# EAGLE schematic BMS_24 (EAGLE 9.6.2)
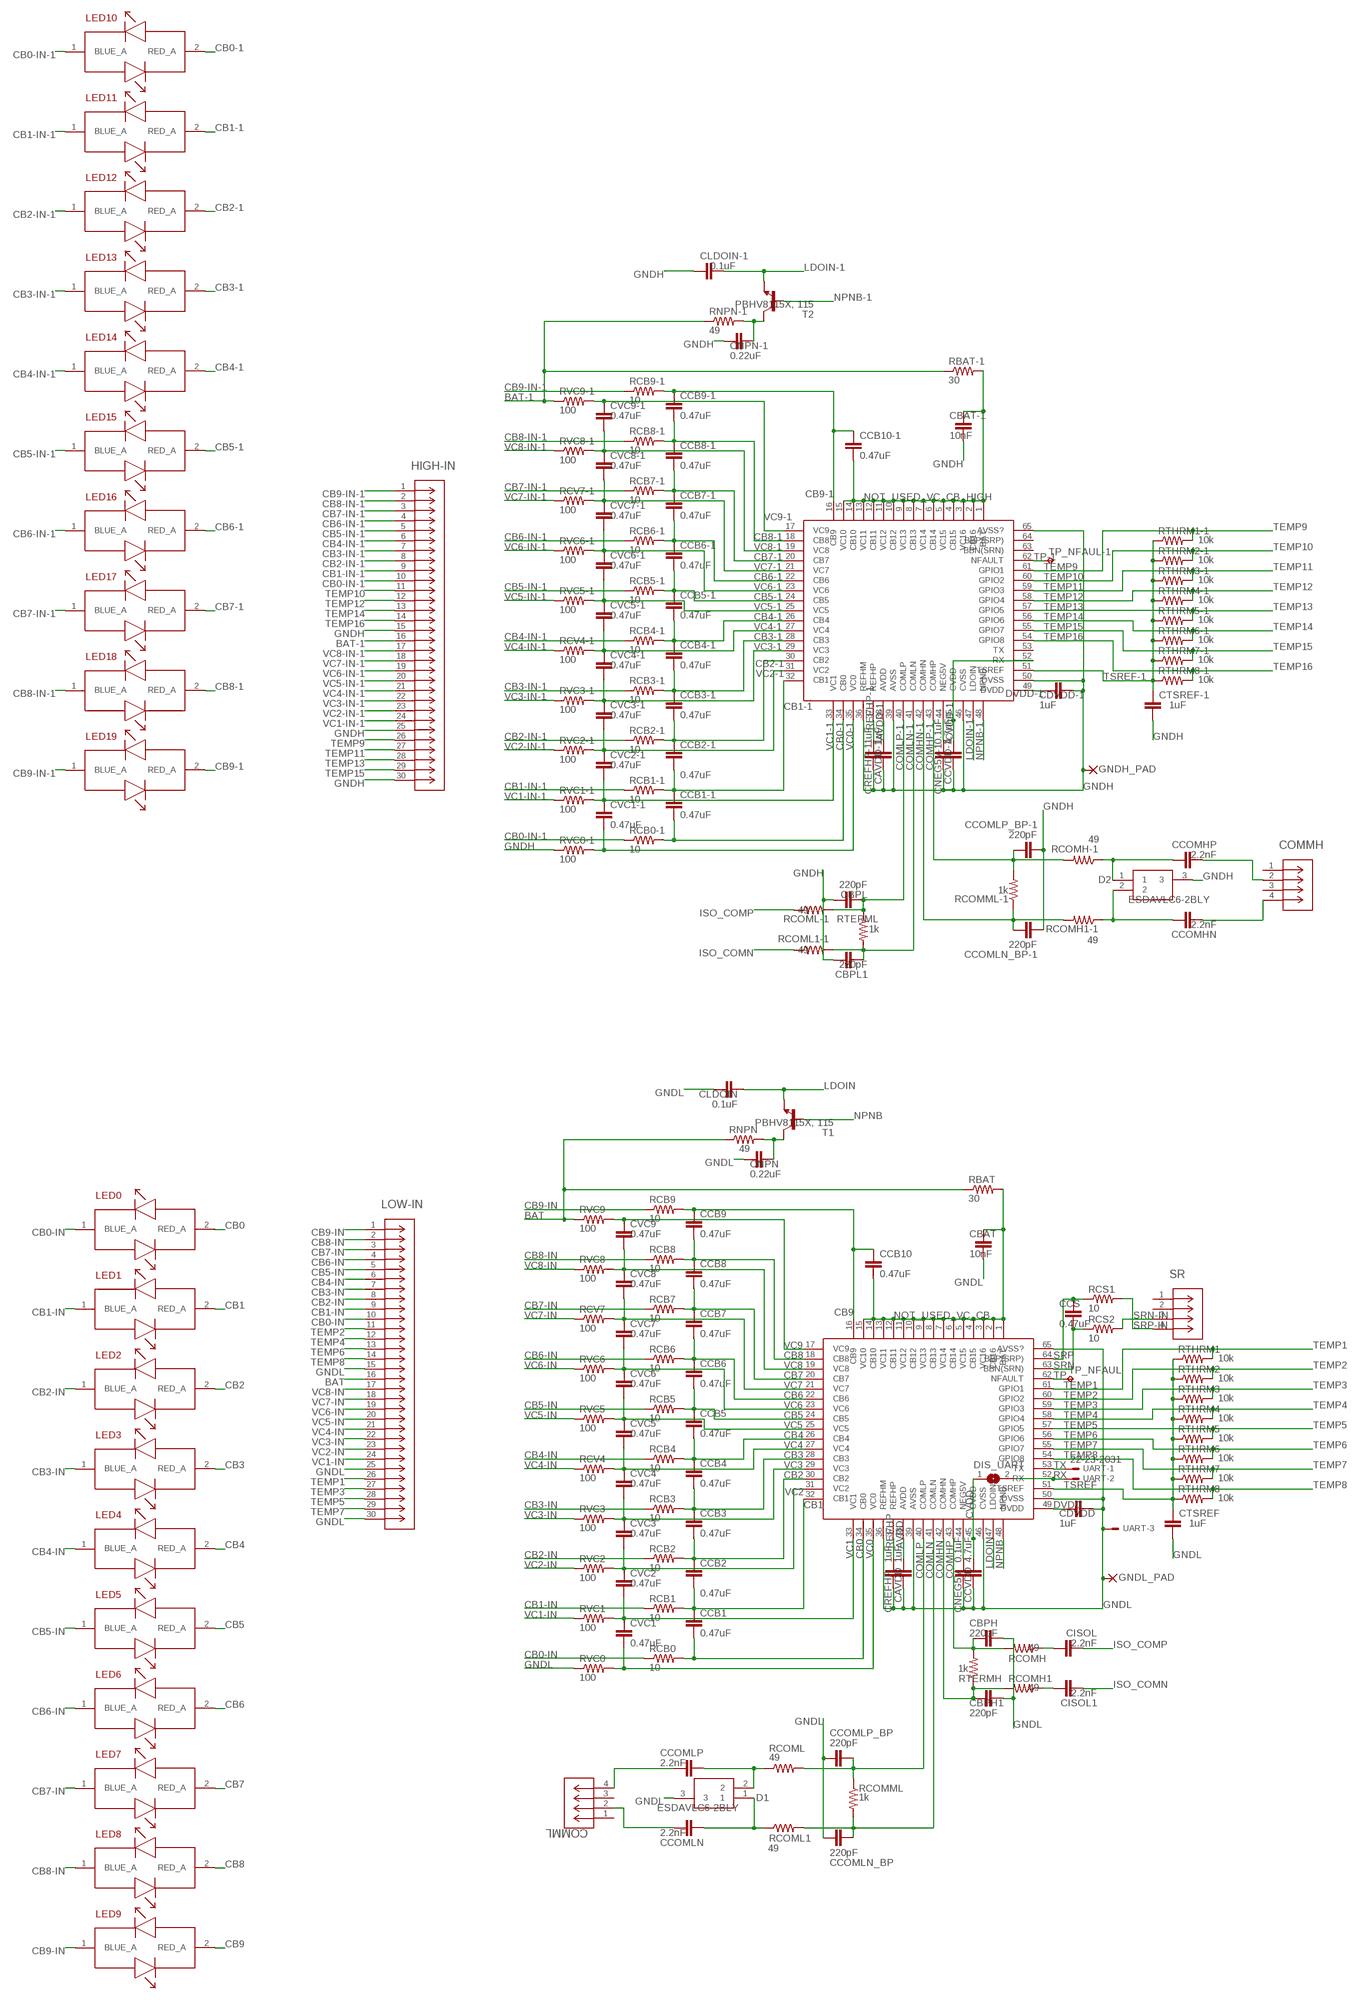
[diagram p0: schematic, sheet 1]

## Parts
CAVDD  1uF  CAPACITORC0603  [C0603]
CAVDD-1  1uF  CAPACITORC0603  [C0603]
CBAT  10nF  CAPACITORC0603  [C0603]
CBAT-1  10nF  CAPACITORC0603  [C0603]
CBPH  220pF  CAPACITORC0603  [C0603]
CBPH1  220pF  CAPACITORC0603  [C0603]
CBPL  220pF  CAPACITORC0603  [C0603]
CBPL1  220pF  CAPACITORC0603  [C0603]
CCB1  0.47uF  CAPACITORC0603  [C0603]
CCB1-1  0.47uF  CAPACITORC0603  [C0603]
CCB2  0.47uF  CAPACITORC0603  [C0603]
CCB2-1  0.47uF  CAPACITORC0603  [C0603]
CCB3  0.47uF  CAPACITORC0603  [C0603]
CCB3-1  0.47uF  CAPACITORC0603  [C0603]
CCB4  0.47uF  CAPACITORC0603  [C0603]
CCB4-1  0.47uF  CAPACITORC0603  [C0603]
CCB5  0.47uF  CAPACITORC0603  [C0603]
CCB5-1  0.47uF  CAPACITORC0603  [C0603]
CCB6  0.47uF  CAPACITORC0603  [C0603]
CCB6-1  0.47uF  CAPACITORC0603  [C0603]
CCB7  0.47uF  CAPACITORC0603  [C0603]
CCB7-1  0.47uF  CAPACITORC0603  [C0603]
CCB8  0.47uF  CAPACITORC0603  [C0603]
CCB8-1  0.47uF  CAPACITORC0603  [C0603]
CCB9  0.47uF  CAPACITORC0603  [C0603]
CCB9-1  0.47uF  CAPACITORC0603  [C0603]
CCB10  0.47uF  CAPACITORC0603  [C0603]
CCB10-1  0.47uF  CAPACITORC0603  [C0603]
CCOMHN  2.2nF  CAPACITORC0603  [C0603]
CCOMHP  2.2nF  CAPACITORC0603  [C0603]
CCOMLN  2.2nF  CAPACITORC0603  [C0603]
CCOMLN_BP  220pF  CAPACITORC0603  [C0603]
CCOMLN_BP-1  220pF  CAPACITORC0603  [C0603]
CCOMLP  2.2nF  CAPACITORC0603  [C0603]
CCOMLP_BP  220pF  CAPACITORC0603  [C0603]
CCOMLP_BP-1  220pF  CAPACITORC0603  [C0603]
CCS  0.47uF  CAPACITORC0603  [C0603]
CCVDD  4.7uF  CAPACITORC0603  [C0603]
CCVDD-1  4.7uF  CAPACITORC0603  [C0603]
CDVDD  1uF  CAPACITORC0603  [C0603]
CDVDD-1  1uF  CAPACITORC0603  [C0603]
CISOL  2.2nF  CAPACITORC0603  [C0603]
CISOL1  2.2nF  CAPACITORC0603  [C0603]
CLDOIN  0.1uF  CAPACITORC0603  [C0603]
CLDOIN-1  0.1uF  CAPACITORC0603  [C0603]
CNEG5V  0.1uF  CAPACITORC0603  [C0603]
CNEG5V-1  0.1uF  CAPACITORC0603  [C0603]
CNPN  0.22uF  CAPACITORC0603  [C0603]
CNPN-1  0.22uF  CAPACITORC0603  [C0603]
COMMH  DF11-4DP-2DSA(24)  [CON4_2X2_UF_DF11_HIR]
COMML  DF11-4DP-2DSA(24)  [CON4_2X2_UF_DF11_HIR]
CREFHP  1uF  CAPACITORC0603  [C0603]
CREFHP-1  1uF  CAPACITORC0603  [C0603]
CTSREF  1uF  CAPACITORC0603  [C0603]
CTSREF-1  1uF  CAPACITORC0603  [C0603]
CVC1  0.47uF  CAPACITORC0603  [C0603]
CVC1-1  0.47uF  CAPACITORC0603  [C0603]
CVC2  0.47uF  CAPACITORC0603  [C0603]
CVC2-1  0.47uF  CAPACITORC0603  [C0603]
CVC3  0.47uF  CAPACITORC0603  [C0603]
CVC3-1  0.47uF  CAPACITORC0603  [C0603]
CVC4  0.47uF  CAPACITORC0603  [C0603]
CVC4-1  0.47uF  CAPACITORC0603  [C0603]
CVC5  0.47uF  CAPACITORC0603  [C0603]
CVC5-1  0.47uF  CAPACITORC0603  [C0603]
CVC6  0.47uF  CAPACITORC0603  [C0603]
CVC6-1  0.47uF  CAPACITORC0603  [C0603]
CVC7  0.47uF  CAPACITORC0603  [C0603]
CVC7-1  0.47uF  CAPACITORC0603  [C0603]
CVC8  0.47uF  CAPACITORC0603  [C0603]
CVC8-1  0.47uF  CAPACITORC0603  [C0603]
CVC9  0.47uF  CAPACITORC0603  [C0603]
CVC9-1  0.47uF  CAPACITORC0603  [C0603]
D1  ESDAVLC6-2BLY  [SOT95P255X150-3N]
D2  ESDAVLC6-2BLY  [SOT95P255X150-3N]
DIS_UART  SJ  [SJ]
GNDH_PAD  SMD2  [SMD1,27-2,54]
GNDL_PAD  SMD2  [SMD1,27-2,54]
HIGH-IN  87606-315LF  [87606-315LF_AMP]
IC1  PBQ79656PAPTQ1  [QFP50P1200X1200X120-65N]
IC2  PBQ79656PAPTQ1  [QFP50P1200X1200X120-65N]
LED0  TJ-S1608SW6TNPGLCRB-A5  [TJ-S1608SW6TNPGLCRB-A5]
LED1  TJ-S1608SW6TNPGLCRB-A5  [TJ-S1608SW6TNPGLCRB-A5]
LED2  TJ-S1608SW6TNPGLCRB-A5  [TJ-S1608SW6TNPGLCRB-A5]
LED3  TJ-S1608SW6TNPGLCRB-A5  [TJ-S1608SW6TNPGLCRB-A5]
LED4  TJ-S1608SW6TNPGLCRB-A5  [TJ-S1608SW6TNPGLCRB-A5]
LED5  TJ-S1608SW6TNPGLCRB-A5  [TJ-S1608SW6TNPGLCRB-A5]
LED6  TJ-S1608SW6TNPGLCRB-A5  [TJ-S1608SW6TNPGLCRB-A5]
LED7  TJ-S1608SW6TNPGLCRB-A5  [TJ-S1608SW6TNPGLCRB-A5]
LED8  TJ-S1608SW6TNPGLCRB-A5  [TJ-S1608SW6TNPGLCRB-A5]
LED9  TJ-S1608SW6TNPGLCRB-A5  [TJ-S1608SW6TNPGLCRB-A5]
LED10  TJ-S1608SW6TNPGLCRB-A5  [TJ-S1608SW6TNPGLCRB-A5]
LED11  TJ-S1608SW6TNPGLCRB-A5  [TJ-S1608SW6TNPGLCRB-A5]
LED12  TJ-S1608SW6TNPGLCRB-A5  [TJ-S1608SW6TNPGLCRB-A5]
LED13  TJ-S1608SW6TNPGLCRB-A5  [TJ-S1608SW6TNPGLCRB-A5]
LED14  TJ-S1608SW6TNPGLCRB-A5  [TJ-S1608SW6TNPGLCRB-A5]
LED15  TJ-S1608SW6TNPGLCRB-A5  [TJ-S1608SW6TNPGLCRB-A5]
LED16  TJ-S1608SW6TNPGLCRB-A5  [TJ-S1608SW6TNPGLCRB-A5]
LED17  TJ-S1608SW6TNPGLCRB-A5  [TJ-S1608SW6TNPGLCRB-A5]
LED18  TJ-S1608SW6TNPGLCRB-A5  [TJ-S1608SW6TNPGLCRB-A5]
LED19  TJ-S1608SW6TNPGLCRB-A5  [TJ-S1608SW6TNPGLCRB-A5]
LOW-IN  87606-315LF  [87606-315LF_AMP]
RBAT  30  RESISTORR0603  [R0603]
RBAT-1  30  RESISTORR0603  [R0603]
RCB0  10  R-US_R1210  [R1210]
RCB0-1  10  R-US_R1210  [R1210]
RCB1  10  R-US_R1210  [R1210]
RCB1-1  10  R-US_R1210  [R1210]
RCB2  10  R-US_R1210  [R1210]
RCB2-1  10  R-US_R1210  [R1210]
RCB3  10  R-US_R1210  [R1210]
RCB3-1  10  R-US_R1210  [R1210]
RCB4  10  R-US_R1210  [R1210]
RCB4-1  10  R-US_R1210  [R1210]
RCB5  10  R-US_R1210  [R1210]
RCB5-1  10  R-US_R1210  [R1210]
RCB6  10  R-US_R1210  [R1210]
RCB6-1  10  R-US_R1210  [R1210]
RCB7  10  R-US_R1210  [R1210]
RCB7-1  10  R-US_R1210  [R1210]
RCB8  10  R-US_R1210  [R1210]
RCB8-1  10  R-US_R1210  [R1210]
RCB9  10  R-US_R1210  [R1210]
RCB9-1  10  R-US_R1210  [R1210]
RCOMH  49  RESISTORR0603  [R0603]
RCOMH1  49  RESISTORR0603  [R0603]
RCOMH1-1  49  RESISTORR0603  [R0603]
RCOMH-1  49  RESISTORR0603  [R0603]
RCOML  49  RESISTORR0603  [R0603]
RCOML1  49  RESISTORR0603  [R0603]
RCOML1-1  49  RESISTORR0603  [R0603]
RCOML-1  49  RESISTORR0603  [R0603]
RCOMML  1k  RESISTORR0603  [R0603]
RCOMML-1  1k  RESISTORR0603  [R0603]
RCS1  10  RESISTORR0603  [R0603]
RCS2  10  RESISTORR0603  [R0603]
RCV4  100  RESISTORR0603  [R0603]
RCV4-1  100  RESISTORR0603  [R0603]
RCV7  100  RESISTORR0603  [R0603]
RCV7-1  100  RESISTORR0603  [R0603]
RNPN  49  RESISTORR0603  [R0603]
RNPN-1  49  RESISTORR0603  [R0603]
RTERMH  1k  RESISTORR0603  [R0603]
RTERML  1k  RESISTORR0603  [R0603]
RTHRM1  10k  RESISTORR0603  [R0603]
RTHRM1-1  10k  RESISTORR0603  [R0603]
RTHRM2  10k  RESISTORR0603  [R0603]
RTHRM2-1  10k  RESISTORR0603  [R0603]
RTHRM3  10k  RESISTORR0603  [R0603]
RTHRM3-1  10k  RESISTORR0603  [R0603]
RTHRM4  10k  RESISTORR0603  [R0603]
RTHRM4-1  10k  RESISTORR0603  [R0603]
RTHRM5  10k  RESISTORR0603  [R0603]
RTHRM5-1  10k  RESISTORR0603  [R0603]
RTHRM6  10k  RESISTORR0603  [R0603]
RTHRM6-1  10k  RESISTORR0603  [R0603]
RTHRM7  10k  RESISTORR0603  [R0603]
RTHRM7-1  10k  RESISTORR0603  [R0603]
RTHRM8  10k  RESISTORR0603  [R0603]
RTHRM8-1  10k  RESISTORR0603  [R0603]
RVC0  100  RESISTORR0603  [R0603]
RVC0-1  100  RESISTORR0603  [R0603]
RVC1  100  RESISTORR0603  [R0603]
RVC1-1  100  RESISTORR0603  [R0603]
RVC2  100  RESISTORR0603  [R0603]
RVC2-1  100  RESISTORR0603  [R0603]
RVC3  100  RESISTORR0603  [R0603]
RVC3-1  100  RESISTORR0603  [R0603]
RVC5  100  RESISTORR0603  [R0603]
RVC5-1  100  RESISTORR0603  [R0603]
RVC6  100  RESISTORR0603  [R0603]
RVC6-1  100  RESISTORR0603  [R0603]
RVC8  100  RESISTORR0603  [R0603]
RVC8-1  100  RESISTORR0603  [R0603]
RVC9  100  RESISTORR0603  [R0603]
RVC9-1  100  RESISTORR0603  [R0603]
SR  DF11-4DP-2DSA(24)  [CON4_2X2_UF_DF11_HIR]
T1  PBHV8115X, 115  BC868-NPN-SOT89-BCE  [SOT89-BCE]
T2  PBHV8115X, 115  BC868-NPN-SOT89-BCE  [SOT89-BCE]
TP_NFAUL  TPB2,54  [B2,54]
TP_NFAUL-1  TPB2,54  [B2,54]
UART  22-23-2031  [22-23-2031]

## Nets
AVDD: CAVDD.1 IC2.38(AVDD)
AVDD-1: CAVDD-1.1 IC1.38(AVDD)
BAT: LOW-IN.16 RBAT.1 RNPN.1 RVC9.1
BAT-1: HIGH-IN.16 RBAT-1.1 RNPN-1.1 RVC9-1.1
CB0: CCB1.2 IC2.34(CB0) LED0.2(RED_A) RCB0.2
CB0-1: CCB1-1.2 IC1.34(CB0) LED10.2(RED_A) RCB0-1.2
CB0-IN: LED0.1(BLUE_A) LOW-IN.10 RCB0.1
CB0-IN-1: HIGH-IN.10 LED10.1(BLUE_A) RCB0-1.1
CB1: CCB1.1 CCB2.2 IC2.32(CB1) LED1.2(RED_A) RCB1.2
CB1-1: CCB1-1.1 CCB2-1.2 IC1.32(CB1) LED11.2(RED_A) RCB1-1.2
CB1-IN: LED1.1(BLUE_A) LOW-IN.9 RCB1.1
CB1-IN-1: HIGH-IN.9 LED11.1(BLUE_A) RCB1-1.1
CB2: CCB2.1 CCB3.2 IC2.30(CB2) LED2.2(RED_A) RCB2.2
CB2-1: CCB2-1.1 CCB3-1.2 IC1.30(CB2) LED12.2(RED_A) RCB2-1.2
CB2-IN: LED2.1(BLUE_A) LOW-IN.8 RCB2.1
CB2-IN-1: HIGH-IN.8 LED12.1(BLUE_A) RCB2-1.1
CB3: CCB3.1 CCB4.2 IC2.28(CB3) LED3.2(RED_A) RCB3.2
CB3-1: CCB3-1.1 CCB4-1.2 IC1.28(CB3) LED13.2(RED_A) RCB3-1.2
CB3-IN: LED3.1(BLUE_A) LOW-IN.7 RCB3.1
CB3-IN-1: HIGH-IN.7 LED13.1(BLUE_A) RCB3-1.1
CB4: CCB4.1 CCB5.2 IC2.26(CB4) LED4.2(RED_A) RCB4.2
CB4-1: CCB4-1.1 CCB5-1.2 IC1.26(CB4) LED14.2(RED_A) RCB4-1.2
CB4-IN: LED4.1(BLUE_A) LOW-IN.6 RCB4.1
CB4-IN-1: HIGH-IN.6 LED14.1(BLUE_A) RCB4-1.1
CB5: CCB5.1 CCB6.2 IC2.24(CB5) LED5.2(RED_A) RCB5.2
CB5-1: CCB5-1.1 CCB6-1.2 IC1.24(CB5) LED15.2(RED_A) RCB5-1.2
CB5-IN: LED5.1(BLUE_A) LOW-IN.5 RCB5.1
CB5-IN-1: HIGH-IN.5 LED15.1(BLUE_A) RCB5-1.1
CB6: CCB6.1 CCB7.2 IC2.22(CB6) LED6.2(RED_A) RCB6.2
CB6-1: CCB6-1.1 CCB7-1.2 IC1.22(CB6) LED16.2(RED_A) RCB6-1.2
CB6-IN: LED6.1(BLUE_A) LOW-IN.4 RCB6.1
CB6-IN-1: HIGH-IN.4 LED16.1(BLUE_A) RCB6-1.1
CB7: CCB7.1 CCB8.2 IC2.20(CB7) LED7.2(RED_A) RCB7.2
CB7-1: CCB7-1.1 CCB8-1.2 IC1.20(CB7) LED17.2(RED_A) RCB7-1.2
CB7-IN: LED7.1(BLUE_A) LOW-IN.3 RCB7.1
CB7-IN-1: HIGH-IN.3 LED17.1(BLUE_A) RCB7-1.1
CB8: CCB8.1 CCB9.2 IC2.18(CB8) LED8.2(RED_A) RCB8.2
CB8-1: CCB8-1.1 CCB9-1.2 IC1.18(CB8) LED18.2(RED_A) RCB8-1.2
CB8-IN: LED8.1(BLUE_A) LOW-IN.2 RCB8.1
CB8-IN-1: HIGH-IN.2 LED18.1(BLUE_A) RCB8-1.1
CB9: CCB9.1 CCB10.2 IC2.16(CB9) LED9.2(RED_A) RCB9.2
CB9-1: CCB9-1.1 CCB10-1.2 IC1.16(CB9) LED19.2(RED_A) RCB9-1.2
CB9-IN: LED9.1(BLUE_A) LOW-IN.1 RCB9.1
CB9-IN-1: HIGH-IN.1 LED19.1(BLUE_A) RCB9-1.1
COMHN: CBPH1.1 IC2.42(COMHN) RCOMH1.2 RTERMH.1
COMHN-1: CCOMLN_BP-1.1 IC1.42(COMHN) RCOMH1-1.2 RCOMML-1.1
COMHP: CBPH.1 IC2.43(COMHP) RCOMH.2 RTERMH.2
COMHP-1: CCOMLP_BP-1.1 IC1.43(COMHP) RCOMH-1.2 RCOMML-1.2
COMLN: CCOMLN_BP.1 IC2.41(COMLN) RCOML1.2 RCOMML.2
COMLN-1: CBPL1.1 IC1.41(COMLN) RCOML1-1.2 RTERML.2
COMLP: CCOMLP_BP.1 IC2.40(COMLP) RCOML.2 RCOMML.1
COMLP-1: CBPL.1 IC1.40(COMLP) RCOML-1.2 RTERML.1
CVDD: CCVDD.1 DIS_UART.1 IC2.45(CVDD)
CVDD-1: CCVDD-1.1 IC1.45(CVDD) IC1.52(RX)
DVDD: CDVDD.1 IC2.49(DVDD)
DVDD-1: CDVDD-1.1 IC1.49(DVDD)
GNDH: CAVDD-1.2 CBAT-1.1 CBPL1.2 CBPL.2 CCOMLN_BP-1.2 CCOMLP_BP-1.2 CCVDD-1.2 CDVDD-1.2 CLDOIN-1.2 CNEG5V-1.2 CNPN-1.1 CREFHP-1.2 CTSREF-1.2 D2.3 GNDH_PAD.1(P) HIGH-IN.15 HIGH-IN.25 HIGH-IN.30 IC1.36(REFHM) IC1.39(AVSS) IC1.46(CVSS) IC1.50(DVSS) IC1.65(AVSS?) RVC0-1.1
GNDL: CAVDD.2 CBAT.1 CBPH1.2 CBPH.2 CCOMLN_BP.2 CCOMLP_BP.2 CCVDD.2 CDVDD.2 CLDOIN.2 CNEG5V.2 CNPN.1 CREFHP.2 CTSREF.2 D1.3 GNDL_PAD.1(P) IC2.36(REFHM) IC2.39(AVSS) IC2.46(CVSS) IC2.50(DVSS) IC2.65(AVSS?) LOW-IN.15 LOW-IN.25 LOW-IN.30 RVC0.1 UART.3
ISO_COMN: CISOL1.1 RCOML1-1.1
ISO_COMP: CISOL.1 RCOML-1.1
LDOIN: CLDOIN.1 IC2.47(LDOIN) T1.E
LDOIN-1: CLDOIN-1.1 IC1.47(LDOIN) T2.E
N$2: CNPN.2 RNPN.2 T1.C
N$6: CNEG5V.1 IC2.44(NEG5V)
N$46: CISOL.2 RCOMH.1
N$47: CISOL1.2 RCOMH1.1
N$50: CCOMLN.2 D1.1 RCOML1.1
N$51: CCOMLP.2 D1.2 RCOML.1
N$73: CNEG5V-1.1 IC1.44(NEG5V)
N$92: CNPN-1.2 RNPN-1.2 T2.C
N$97: CCOMHP.2 D2.1 RCOMH-1.1
N$98: CCOMHN.2 D2.2 RCOMH1-1.1
N$99: CCOMHP.1 COMMH.2
N$101: CCOMHN.1 COMMH.4
N$103: CCOMLN.1 COMML.2
N$104: CCOMLP.1 COMML.4
NOT_USED_VC_CB: CBAT.2 CCB10.1 IC2.1(BAT) IC2.2(CB16) IC2.3(VC16) IC2.4(CB15) IC2.5(VC15) IC2.6(CB14) IC2.7(VC14) IC2.8(CB13) IC2.9(VC13) IC2.10(CB12) IC2.11(VC12) IC2.12(CB11) IC2.13(VC11) IC2.14(CB10) IC2.15(VC10) RBAT.2
NOT_USED_VC_CB_HIGH: CBAT-1.2 CCB10-1.1 IC1.1(BAT) IC1.2(CB16) IC1.3(VC16) IC1.4(CB15) IC1.5(VC15) IC1.6(CB14) IC1.7(VC14) IC1.8(CB13) IC1.9(VC13) IC1.10(CB12) IC1.11(VC12) IC1.12(CB11) IC1.13(VC11) IC1.14(CB10) IC1.15(VC10) RBAT-1.2
NPNB: IC2.48(NPNB) T1.B
NPNB-1: IC1.48(NPNB) T2.B
REFHP: CREFHP.1 IC2.37(REFHP)
REFHP-1: CREFHP-1.1 IC1.37(REFHP)
RX: DIS_UART.2 IC2.52(RX) UART.2
SRN: CCS.1 IC2.63(BBN(SRN)) RCS2.1
SRN-IN: RCS2.2 SR.3
SRP: CCS.2 IC2.64(BBP(SRP)) RCS1.1
SRP-IN: RCS1.2 SR.4
TEMP1: IC2.61(GPIO1) LOW-IN.26 RTHRM1.2
TEMP2: IC2.60(GPIO2) LOW-IN.11 RTHRM2.2
TEMP3: IC2.59(GPIO3) LOW-IN.27 RTHRM3.2
TEMP4: IC2.58(GPIO4) LOW-IN.12 RTHRM4.2
TEMP5: IC2.57(GPIO5) LOW-IN.28 RTHRM5.2
TEMP6: IC2.56(GPIO6) LOW-IN.13 RTHRM6.2
TEMP7: IC2.55(GPIO7) LOW-IN.29 RTHRM7.2
TEMP8: IC2.54(GPIO8) LOW-IN.14 RTHRM8.2
TEMP9: HIGH-IN.26 IC1.61(GPIO1) RTHRM1-1.2
TEMP10: HIGH-IN.11 IC1.60(GPIO2) RTHRM2-1.2
TEMP11: HIGH-IN.27 IC1.59(GPIO3) RTHRM3-1.2
TEMP12: HIGH-IN.12 IC1.58(GPIO4) RTHRM4-1.2
TEMP13: HIGH-IN.28 IC1.57(GPIO5) RTHRM5-1.2
TEMP14: HIGH-IN.13 IC1.56(GPIO6) RTHRM6-1.2
TEMP15: HIGH-IN.29 IC1.55(GPIO7) RTHRM7-1.2
TEMP16: HIGH-IN.14 IC1.54(GPIO8) RTHRM8-1.2
TP: IC2.62(NFAULT) TP_NFAUL.TP
TP-1: IC1.62(NFAULT) TP_NFAUL-1.TP
TSREF: CTSREF.1 IC2.51(TSREF) RTHRM1.1 RTHRM2.1 RTHRM3.1 RTHRM4.1 RTHRM5.1 RTHRM6.1 RTHRM7.1 RTHRM8.1
TSREF-1: CTSREF-1.1 IC1.51(TSREF) RTHRM1-1.1 RTHRM2-1.1 RTHRM3-1.1 RTHRM4-1.1 RTHRM5-1.1 RTHRM6-1.1 RTHRM7-1.1 RTHRM8-1.1
TX: IC2.53(TX) UART.1
VC0: CVC1.2 IC2.35(VC0) RVC0.2
VC0-1: CVC1-1.2 IC1.35(VC0) RVC0-1.2
VC1: CVC1.1 CVC2.2 IC2.33(VC1) RVC1.2
VC1-1: CVC1-1.1 CVC2-1.2 IC1.33(VC1) RVC1-1.2
VC1-IN: LOW-IN.24 RVC1.1
VC1-IN-1: HIGH-IN.24 RVC1-1.1
VC2: CVC2.1 CVC3.2 IC2.31(VC2) RVC2.2
VC2-1: CVC2-1.1 CVC3-1.2 IC1.31(VC2) RVC2-1.2
VC2-IN: LOW-IN.23 RVC2.1
VC2-IN-1: HIGH-IN.23 RVC2-1.1
VC3: CVC3.1 CVC4.2 IC2.29(VC3) RVC3.2
VC3-1: CVC3-1.1 CVC4-1.2 IC1.29(VC3) RVC3-1.2
VC3-IN: LOW-IN.22 RVC3.1
VC3-IN-1: HIGH-IN.22 RVC3-1.1
VC4: CVC4.1 CVC5.2 IC2.27(VC4) RCV4.2
VC4-1: CVC4-1.1 CVC5-1.2 IC1.27(VC4) RCV4-1.2
VC4-IN: LOW-IN.21 RCV4.1
VC4-IN-1: HIGH-IN.21 RCV4-1.1
VC5: CVC5.1 CVC6.2 IC2.25(VC5) RVC5.2
VC5-1: CVC5-1.1 CVC6-1.2 IC1.25(VC5) RVC5-1.2
VC5-IN: LOW-IN.20 RVC5.1
VC5-IN-1: HIGH-IN.20 RVC5-1.1
VC6: CVC6.1 CVC7.2 IC2.23(VC6) RVC6.2
VC6-1: CVC6-1.1 CVC7-1.2 IC1.23(VC6) RVC6-1.2
VC6-IN: LOW-IN.19 RVC6.1
VC6-IN-1: HIGH-IN.19 RVC6-1.1
VC7: CVC7.1 CVC8.2 IC2.21(VC7) RCV7.2
VC7-1: CVC7-1.1 CVC8-1.2 IC1.21(VC7) RCV7-1.2
VC7-IN: LOW-IN.18 RCV7.1
VC7-IN-1: HIGH-IN.18 RCV7-1.1
VC8: CVC8.1 CVC9.2 IC2.19(VC8) RVC8.2
VC8-1: CVC8-1.1 CVC9-1.2 IC1.19(VC8) RVC8-1.2
VC8-IN: LOW-IN.17 RVC8.1
VC8-IN-1: HIGH-IN.17 RVC8-1.1
VC9: CVC9.1 IC2.17(VC9) RVC9.2
VC9-1: CVC9-1.1 IC1.17(VC9) RVC9-1.2
Unconnected: COMMH.1 COMMH.3 COMML.1 COMML.3 IC1.53(TX) IC1.63(BBN(SRN)) IC1.64(BBP(SRP)) SR.1 SR.2

## Library data of the parts
CAVDD CAVDD-1 CBAT CBAT-1 CBPH CBPH1 CBPL CBPL1 CCB1 CCB1-1 CCB2 CCB2-1 CCB3 CCB3-1 CCB4 CCB4-1 CCB5 CCB5-1 CCB6 CCB6-1 CCB7 CCB7-1 CCB8 CCB8-1 CCB9 CCB9-1 CCB10 CCB10-1 CCOMHN CCOMHP CCOMLN CCOMLN_BP CCOMLN_BP-1 CCOMLP CCOMLP_BP CCOMLP_BP-1 CCS CCVDD CCVDD-1 CDVDD CDVDD-1 CISOL CISOL1 CLDOIN CLDOIN-1 CNEG5V CNEG5V-1 CNPN CNPN-1 CREFHP CREFHP-1 CTSREF CTSREF-1 CVC1 CVC1-1 CVC2 CVC2-1 CVC3 CVC3-1 CVC4 CVC4-1 CVC5 CVC5-1 CVC6 CVC6-1 CVC7 CVC7-1 CVC8 CVC8-1 CVC9 CVC9-1 = NFR23_v1.3:CAPACITOR: CAPACITOR, European symbol; SPICEPREFIX: C
COMMH COMML SR = BMS24:DF11-4DP-2DSA(24); COPYRIGHT: Copyright (C) 2023 Ultra Librarian. All rights reserved.; MANUFACTURER_PART_NUMBER: DF11-4DP-2DSA(24); MFR_NAME: Hirose
D1 D2 = ESDAVLC6-2BLY:ESDAVLC6-2BLY: STMICROELECTRONICS - ESDAVLC6-2BLY - ESD Protection Device, 17 V, SOT-23, 3 Pins, 5 V, 140 W, ESDA Transil Series Source: Datasheet <http://www.st.com/resource/en/datasheet/esdavlc6-2bly.pdf>; DESCRIPTION: STMICROELECTRONICS - ESDAVLC6-2BLY - ESD Protection Device, 17 V, SOT-23, 3 Pins, 5 V, 140 W, ESDA Transil Series; HEIGHT: 1.5mm; MANUFACTURER_NAME: STMicroelectronics; MANUFACTURER_PART_NUMBER: ESDAVLC6-2BLY; MOUSER_PART_NUMBER: 511-ESDAVLC6-2BLY; MOUSER_PRICE-STOCK: https://www.mouser.co.uk/ProductDetail/STMicroelectronics/ESDAVLC6-2BLY?qs=l7cgNqFNU1iH2e21evvYsA%3D%3D
DIS_UART = jumper:SJ: SMD solder JUMPER
GNDH_PAD GNDL_PAD = wirepad:SMD2: SMD PAD
HIGH-IN LOW-IN = BMS24:87606-315LF; COPYRIGHT: Copyright (C) 2024 Ultra Librarian. All rights reserved.; MANUFACTURER_PART_NUMBER: 87606-315LF; MFR_NAME: Amphenol ICC
IC1 IC2 = PBQ79656PAPTQ1:PBQ79656PAPTQ1: BQ7965x-Q1 Family of 12S, 14S, 16S Precision Automotive Battery Monitor, Balancer and Integrated Hardware Protector with up to SafeTITM-26262 ASIL-D Compliance Source: Datasheet <http://www.ti.com/lit/ds/symlink/bq79616-q1.pdf>; DESCRIPTION: BQ7965x-Q1 Family of 12S, 14S, 16S Precision Automotive Battery Monitor, Balancer and Integrated Hardware Protector with up to SafeTITM-26262 ASIL-D Compliance; HEIGHT: 1.2mm; MANUFACTURER_NAME: Texas Instruments; MANUFACTURER_PART_NUMBER: PBQ79656PAPTQ1
LED0 LED1-LED19 = led_to_eagle:TJ-S1608SW6TNPGLCRB-A5
RBAT RBAT-1 RCOMH RCOMH1 RCOMH1-1 RCOMH-1 RCOML RCOML1 RCOML1-1 RCOML-1 RCOMML RCOMML-1 RCS1 RCS2 RCV4 RCV4-1 RCV7 RCV7-1 RNPN RNPN-1 RTERMH RTERML RTHRM1 RTHRM1-1 RTHRM2 RTHRM2-1 RTHRM3 RTHRM3-1 RTHRM4 RTHRM4-1 RTHRM5 RTHRM5-1 RTHRM6 RTHRM6-1 RTHRM7 RTHRM7-1 RTHRM8 RTHRM8-1 RVC0 RVC0-1 RVC1 RVC1-1 RVC2 RVC2-1 RVC3 RVC3-1 RVC5 RVC5-1 RVC6 RVC6-1 RVC8 RVC8-1 RVC9 RVC9-1 = NFR23_v1.3:RESISTOR: RESISTOR, American symbol
RCB0 RCB0-1 RCB1 RCB1-1 RCB2 RCB2-1 RCB3 RCB3-1 RCB4 RCB4-1 RCB5 RCB5-1 RCB6 RCB6-1 RCB7 RCB7-1 RCB8 RCB8-1 RCB9 RCB9-1 = rcl:R-US_: RESISTOR, American symbol; SPICEPREFIX: R
T1 T2 = transistor:*-NPN-: NPN Transistror BF959 corrected 2008.03.06
TP_NFAUL TP_NFAUL-1 = testpad:TP: Test pad
UART = con-molex:22-23-2031: .100" (2.54mm) Center Header - 3 Pin; MF: MOLEX; MPN: 22-23-2031; OC_FARNELL: 1462950; OC_NEWARK: 30C0862